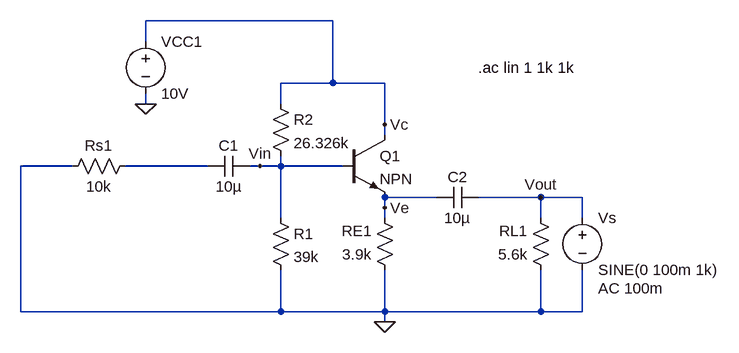
[diagram p0: schematic Common Collector - Rout.asc]
Common Collector - Rout.asc, the LTspice schematic file:
Version 4
SHEET 1 880 680
WIRE 112 -48 -176 -48
WIRE -176 -16 -176 -48
WIRE 112 48 112 -48
WIRE 112 48 32 48
WIRE 192 48 112 48
WIRE -176 80 -176 64
WIRE 32 80 32 48
WIRE 192 112 192 48
WIRE 192 128 192 112
WIRE -288 176 -368 176
WIRE -80 176 -208 176
WIRE 0 176 -16 176
WIRE 32 176 32 160
WIRE 32 176 0 176
WIRE 128 176 32 176
WIRE 272 224 192 224
WIRE 432 224 336 224
WIRE 496 224 432 224
WIRE 192 240 192 224
WIRE 32 256 32 176
WIRE 192 256 192 240
WIRE 432 256 432 224
WIRE 496 256 496 224
WIRE -368 400 -368 176
WIRE 32 400 32 336
WIRE 32 400 -368 400
WIRE 192 400 192 336
WIRE 192 400 32 400
WIRE 432 400 432 336
WIRE 432 400 192 400
WIRE 496 400 496 336
WIRE 496 400 432 400
WIRE 192 416 192 400
FLAG -176 80 0
FLAG 432 224 Vout
FLAG 192 112 Vc
FLAG 192 240 Ve
FLAG 192 416 0
FLAG 0 176 Vin
SYMBOL voltage -176 -32 R0
SYMATTR InstName VCC1
SYMATTR Value 10V
SYMBOL res 16 240 R0
SYMATTR InstName R1
SYMATTR Value 39k
SYMBOL res -192 160 R90
WINDOW 0 0 56 VBottom 2
WINDOW 3 32 56 VTop 2
SYMATTR InstName Rs1
SYMATTR Value 10k
SYMBOL res 208 352 R180
WINDOW 0 36 76 Left 2
WINDOW 3 36 40 Left 2
SYMATTR InstName RE1
SYMATTR Value 3.9k
SYMBOL res 448 352 R180
WINDOW 0 36 76 Left 2
WINDOW 3 36 40 Left 2
SYMATTR InstName RL1
SYMATTR Value 5.6k
SYMBOL cap -16 160 R90
WINDOW 0 0 32 VBottom 2
WINDOW 3 32 32 VTop 2
SYMATTR InstName C1
SYMATTR Value 10µ
SYMBOL cap 336 208 R90
WINDOW 0 0 32 VBottom 2
WINDOW 3 32 32 VTop 2
SYMATTR InstName C2
SYMATTR Value 10µ
SYMBOL npn 128 128 R0
SYMATTR InstName Q1
SYMBOL res 16 64 R0
SYMATTR InstName R2
SYMATTR Value 26.326k
SYMBOL voltage 496 240 R0
WINDOW 123 24 124 Left 2
WINDOW 39 0 0 Left 0
SYMATTR Value2 AC 100m
SYMATTR InstName Vs
SYMATTR Value SINE(0 100m 1k)
TEXT 336 24 Left 2 !.ac lin 1 1k 1k

The netlist it stands for:
* Common Collector - Rout.asc
VCC1 Vc 0 10V
R1 Vin 0 39k
Rs1 N001 0 10k
RE1 0 Ve 3.9k
RL1 0 Vout 5.6k
C1 Vin N001 10µ
C2 Vout Ve 10µ
Q1 Vc Vin Ve 0 NPN
R2 Vc Vin 26.326k
Vs Vout 0 SINE(0 100m 1k) AC 100m
.model NPN NPN
.model PNP PNP
.lib standard.bjt
.ac lin 1 1k 1k
.backanno
.end